# EAGLE design RawWaves_v1-1 (EAGLE 9.6.2)
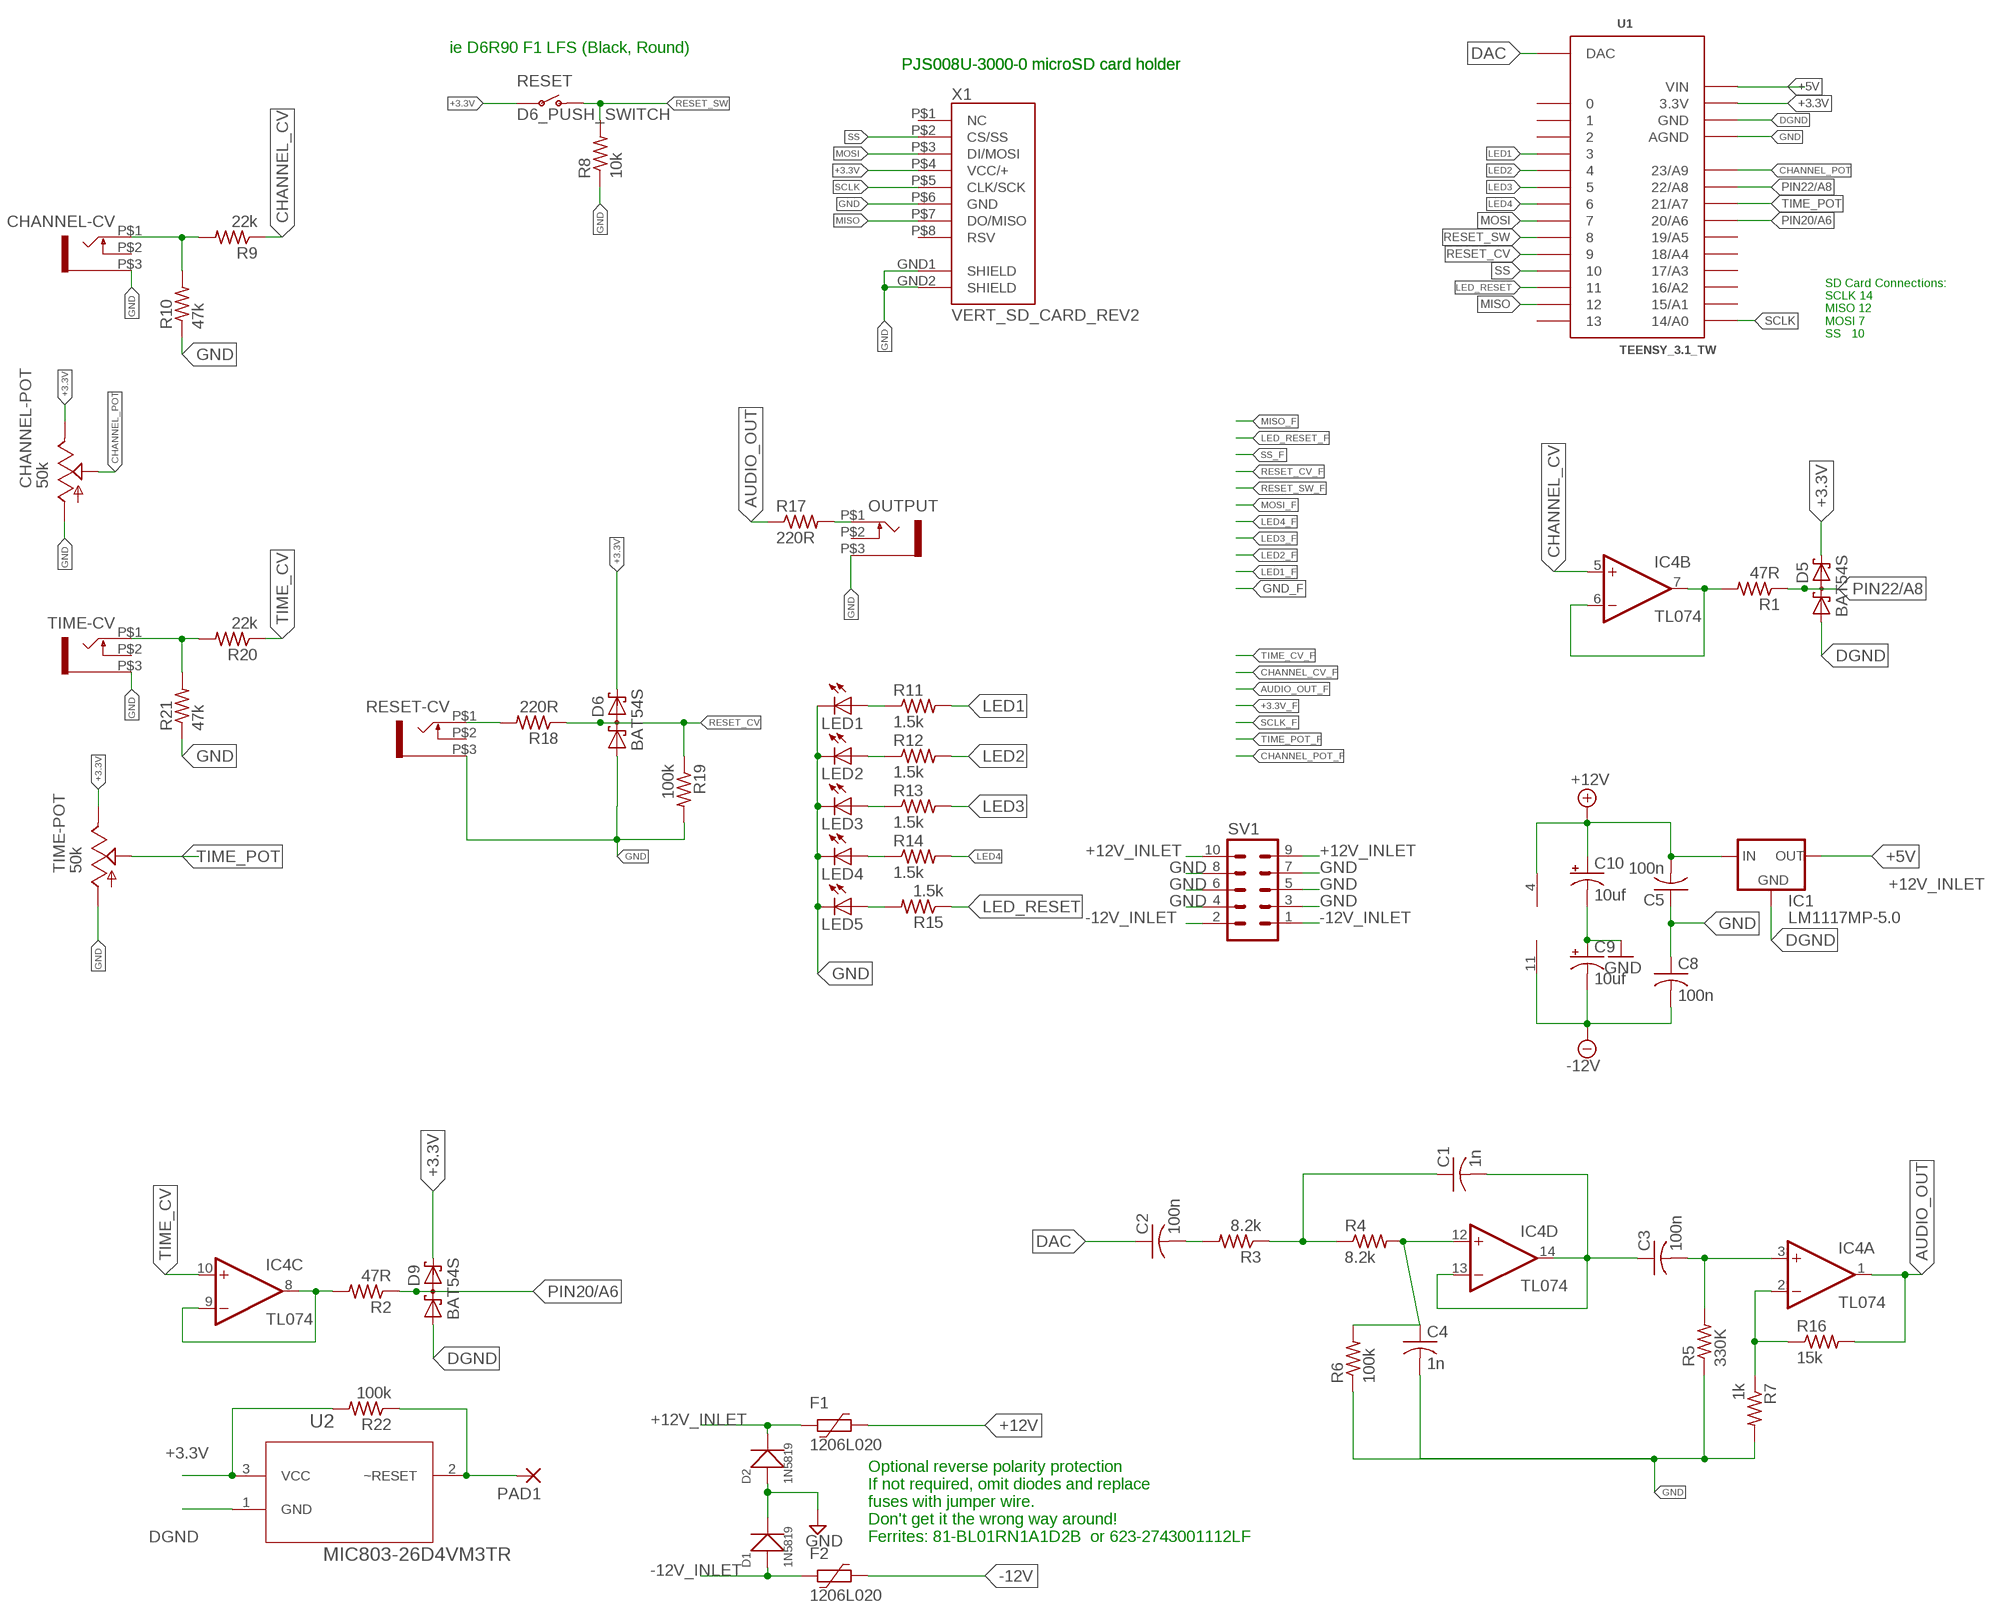
[diagram p0: schematic, sheet 1]

## Parts
C1  1n  C-USC0805  [C0805]
C2  100n  C-USC0805  [C0805]
C3  100n  C-USC0805  [C0805]
C4  1n  C-USC0805  [C0805]
C5  100n  C-USC0805  [C0805]
C8  100n  C-USC0805  [C0805]
C9  10uf  CPOL-USB  [PANASONIC_B]
C10  10uf  CPOL-USB  [PANASONIC_B]
CHANNEL-CV  WQP-PJ301M-12_JACK  [WQP-PJ301M-12_JACK]
CHANNEL-POT  50k  ALPHA-9MMF2A  [EVUF]
D1  1N5819  SMD-DIODE-SCHOTTKY-40V-500MA(SOD-123)  [SOD-123]
D2  1N5819  SMD-DIODE-SCHOTTKY-40V-500MA(SOD-123)  [SOD-123]
D5  BAT54S  [SOT23]
D6  BAT54S  [SOT23]
D9  BAT54S  [SOT23]
F1  1206L020  [1206L]
F2  1206L020  [1206L]
IC1  LM1117MP-5.0  [SOT223]
IC4  TL074  TL074D  [SO14]
LED1  LED3MM  [LED3MM]
LED2  LED3MM  [LED3MM]
LED3  LED3MM  [LED3MM]
LED4  LED3MM  [LED3MM]
LED5  LED3MM  [LED3MM]
OUTPUT  WQP-PJ301M-12_JACK  [WQP-PJ301M-12_JACK]
PAD1  1,6/0,9  [1,6/0,9]
R1  47R  R-US_R0805  [R0805]
R2  47R  R-US_R0805  [R0805]
R3  8.2k  R-US_R0805  [R0805]
R4  8.2k  R-US_R0805  [R0805]
R5  330K  R-US_R0805  [R0805]
R6  100k  R-US_R0805  [R0805]
R7  1k  R-US_R0805  [R0805]
R8  10k  R-US_R0805  [R0805]
R9  22k  R-US_R0805  [R0805]
R10  47k  R-US_R0805  [R0805]
R11  1.5k  R-US_R0805  [R0805]
R12  1.5k  R-US_R0805  [R0805]
R13  1.5k  R-US_R0805  [R0805]
R14  1.5k  R-US_R0805  [R0805]
R15  1.5k  R-US_R0805  [R0805]
R16  15k  R-US_R0805  [R0805]
R17  220R  R-US_R0805  [R0805]
R18  220R  R-US_R0805  [R0805]
R19  100k  R-US_R0805  [R0805]
R20  22k  R-US_R0805  [R0805]
R21  47k  R-US_R0805  [R0805]
R22  100k  R-US_R0805  [R0805]
RESET  D6_PUSH_SWITCH  [D6_BUTTON_RND]
RESET-CV  WQP-PJ301M-12_JACK  [WQP-PJ301M-12_JACK]
SV1  10_PIN_HEADER  [MA05-2]
TIME-CV  WQP-PJ301M-12_JACK  [WQP-PJ301M-12_JACK]
TIME-POT  50k  ALPHA-9MMF2A  [EVUF]
U1  TEENSY_3.1_TW  [TEENSY_3.1_TW]
U2  MIC803-26D4VM3TR  [SOT95P232X110-3N]
X1  VERT_SD_CARD_REV2  [VERT_MICROSD_REV2]

## Nets
+3.3V: CHANNEL-POT.3(E) D5.2(C2) D6.2(C2) D9.2(C2) R22.2 RESET.P$3(P) RESET.P$4(P) TIME-POT.3(E) U1.3.3V U2.3(VCC) X1.P$4(VCC/+)
+5V: IC1.2(OUT) IC1.4(OUT) U1.VIN
+12V [power]: C5.2 C10.+ F1.1 IC1.3(IN) IC4.4(P:V+)
+12V_INLET [power]: D2.- F1.2 SV1.9 SV1.10
-12V [power]: C8.2 C9.- F2.1 IC4.11(P:V-)
-12V_INLET [power]: D1.+ F2.2 SV1.1 SV1.2
AUDIO_OUT: IC4.1(A:OUT) R16.2 R17.1
CHANNEL_CV: IC4.5(B:+IN) R9.1
CHANNEL_POT: CHANNEL-POT.2(S) U1.23/A9
DAC: C2.1 U1.DAC
DGND: D5.1(A1) D9.1(A1) IC1.1(GND) U1.GND U2.1(GND)
GND [ground]: C4.2 C5.1 C8.1 C9.+ C10.- CHANNEL-CV.P$3 CHANNEL-POT.1(A) D1.- D2.+ D6.1(A1) LED1.K(C) LED2.K(C) LED3.K(C) LED4.K(C) LED5.K(C) OUTPUT.P$3 R5.1 R6.1 R7.2 R8.1 R10.1 R19.2 R21.1 RESET-CV.P$3 SV1.3 SV1.4 SV1.5 SV1.6 SV1.7 SV1.8 TIME-CV.P$3 TIME-POT.1(A) U1.AGND X1.GND1(SHIELD) X1.GND2(SHIELD) X1.P$6(GND)
LED1: R11.2 U1.3
LED2: R12.2 U1.4
LED3: R13.2 U1.5
LED4: R14.2 U1.6
LED_RESET: R15.1 U1.11
MISO: U1.12 X1.P$7(DO/MISO)
MOSI: U1.7 X1.P$3(DI/MOSI)
N$1: IC4.6(B:-IN) IC4.7(B:OUT) R1.2
N$2: C4.1 IC4.12(D:+IN) R4.2 R6.2
N$3: OUTPUT.P$1 R17.2
N$4: C1.1 R3.1 R4.1
N$5: C1.2 C3.1 IC4.13(D:-IN) IC4.14(D:OUT)
N$6: C3.2 IC4.3(A:+IN) R5.2
N$7: IC4.2(A:-IN) R7.1 R16.1
N$8: IC4.8(C:OUT) IC4.9(C:-IN) R2.2
N$9: CHANNEL-CV.P$1 R9.2 R10.2
N$10: C2.2 R3.2
N$11: LED2.A R12.1
N$12: LED4.A R14.1
N$13: LED3.A R13.1
N$14: R18.2 RESET-CV.P$1
N$15: LED1.A R11.1
N$16: LED5.A R15.2
N$17: PAD1.1(P) R22.1 U2.2(~RESET)
PIN20/A6: D9.3(C1A2) R2.1 U1.20/A6
PIN22/A8: D5.3(C1A2) R1.1 U1.22/A8
RESET_CV: D6.3(C1A2) R18.1 R19.1 U1.9
RESET_SW: R8.2 RESET.P$1(O) RESET.P$2(O) U1.8
SCLK: U1.14/A0 X1.P$5(CLK/SCK)
SS: U1.10 X1.P$2(CS/SS)
TEMP: R20.2 R21.2 TIME-CV.P$1
TIME_CV: IC4.10(C:+IN) R20.1
TIME_POT: TIME-POT.2(S) U1.21/A7
Unconnected: CHANNEL-CV.P$2 OUTPUT.P$2 RESET-CV.P$2 TIME-CV.P$2 U1.0 U1.1 U1.2 U1.13 U1.15/A1 U1.16/A2 U1.17/A3 U1.18/A4 U1.19/A5 X1.P$1(NC) X1.P$8(RSV)

## Notes on the sheet
- ie D6R90 F1 LFS (Black, Round)
- PJS008U-3000-0 microSD card holder | PJS008U-3000-0 microSD card holder
- SD Card Connections: 
   SCLK 14
   MISO 12
   MOSI 7 
   SS   10
- Optional reverse polarity protection
  If not required, omit diodes and replace
  fuses with jumper wire. 
  Don't get it the wrong way around! 
  Ferrites: 81-BL01RN1A1D2B  or 623-2743001112LF

## Library data of the parts
C1-C5 C8 = rcl:C-US: CAPACITOR, American symbol; SPICEPREFIX: C
C9 C10 = resistor:CPOL-US: POLARIZED CAPACITOR, American symbol
CHANNEL-CV OUTPUT RESET-CV TIME-CV = thonkiconn:WQP-PJ301M-12_JACK
CHANNEL-POT TIME-POT = TomW:ALPHA-9MM: 9 mm Square Rotary Potentiometers Source: Panasonic
D1 D2 = Seeed-Diode:SMD-DIODE-SCHOTTKY-40V-500MA(SOD-123): 304020012; MPN: B0540W; VALUE: 40V-500MA
D5 D6 D9 = diode:BAT54S: Schottky Diodes Pin connection corrected 2011-05-04 Source: Fairchild .. BAT54.pdf
F1 F2 = polyfuse-smd_10:?: Polyfuse Resettable PTC Source: http://www.littelfuse.com/products/resettable-ptcs.aspx; MF: Littelfuse; MPN: 1206L020; OC_FARNELL: 2072173; OC_NEWARK: 05M2300
IC1 = lm1117:LM1117?-*: 800mA Low-Dropout Linear Regulator Source: http://ww1.microchip.com/downloads/en/DeviceDoc/39760d.pdf; MF: Texas Instruments; MPN: LM1117MP-5.0; OC_FARNELL: 9778209; OC_NEWARK: 28X3417
IC4 = linear:TL074: OP AMP
LED1-LED5 = TomW:LED: LED OSRAM: - CHIPLED LG R971, LG N971, LY N971, LG Q971, LY Q971, LO R971, LY R971 LH N974, LH R974 LS Q976, LO Q976, LY Q976 LO Q996 - Hyper CHIPLED LW Q18S LB Q993, LB Q99A, LB R99A - SideLED LS A670, LO A670, LY A670, LG A670, LP A670 LB A673, LV A673, LT A673, LW A673 LH A674 LY A675 LS A676, LA A676, LO A676, LY A676, LW A676 LS A679, LY A679, LG A679 - Hyper Micro SIDELED® LS Y876, LA Y876, LO Y876, LY Y876 LT Y87S - SmartLED LW L88C, LW L88S LB L89C, LB L89S, LG L890 LS L89K, LO L89K, LY L89K LS L896, LA L896, LO L896, LY L896 - TOPLED LS T670, LO T670, LY T670, LG T670, LP T670 LSG T670, LSP T670, LSY T670, LOP T670, LYG T670 LG T671, LOG T671, LSG T671 LB T673, LV T673, LT T673, LW T673 LH T674 LS T676, LA T676, LO T676, LY T676, LB T676, LH T676, LSB T676, LW T676 LB T67C, LV T67C, LT T67C, LS T67K, LO T67K, LY T67K, LW E67C LS E67B, LA E67B, LO E67B, LY E67B, LB E67C, LV E67C, LT E67C LW T67C LS T679, LY T679, LG T679 LS T770, LO T770, LY T770, LG T770, LP T770 LB T773, LV T773, LT T773, LW T773 LH T774 LS E675, LA E675, LY E675, LS T675 LS T776, LA T776, LO T776, LY T776, LB T776 LHGB T686 LT T68C, LB T68C - Hyper Mini TOPLED® LB M676 - Mini TOPLED Santana® LG M470 LS M47K, LO M47K, LY M47K Source: http://www.osram.convergy.de LUXEON: - LUMILED® LXK2-PW12-R00, LXK2-PW12-S00, LXK2-PW14-U00, LXK2-PW14-V00 LXK2-PM12-R00, LXK2-PM12-S00, LXK2-PM14-U00 LXK2-PE12-Q00, LXK2-PE12-R00, LXK2-PE12-S00, LXK2-PE14-T00, LXK2-PE14-U00 LXK2-PB12-K00, LXK2-PB12-L00, LXK2-PB12-M00, LXK2-PB14-N00, LXK2-PB14-P00, LXK2-PB14-Q00 LXK2-PR12-L00, LXK2-PR12-M00, LXK2-PR14-Q00, LXK2-PR14-R00 LXK2-PD12-Q00, LXK2-PD12-R00, LXK2-PD12-S00 LXK2-PH12-R00, LXK2-PH12-S00 LXK2-PL12-P00, LXK2-PL12-Q00, LXK2-PL12-R00 Source: www.luxeon.com KINGBRIGHT: KA-3528ASYC Source: www.kingbright.com
PAD1 = wirepad:1,6/0,9: THROUGH-HOLE PAD
R1-R22 = rcl:R-US_: RESISTOR, American symbol; SPICEPREFIX: R
RESET = TomW:D6_PUSH_SWITCH
SV1 = TomW:10_PIN_HEADER: PIN HEADER; OC_FARNELL: unknown; OC_NEWARK: unknown
U1 = TomW:TEENSY_3.1_TW: Basic Teensy 3.0 with none of the 'inner' pins enabled. See '+4', 'AllAnalogPins", and 'AllPins' packages for additional pin holes, as needed.
U2 = Micrel_By_element14_Batch_1:MIC803-26D4VM3TR: 3 Pin Microprocessor Supervisor Circuit with Open Drain Reset Output; MPN: MIC803-26D4VM3TR; OC_FARNELL: 1924763; OC_NEWARK: 58T4945; PACKAGE: SOT-23-3; SUPPLIER: MICREL SEMICONDUCTOR
X1 = TomW:VERT_SD_CARD_REV2

## Net classes
0 default: width 0.203 mm
1 power: width 0.305 mm
2 ground: width 0.305 mm

## Board
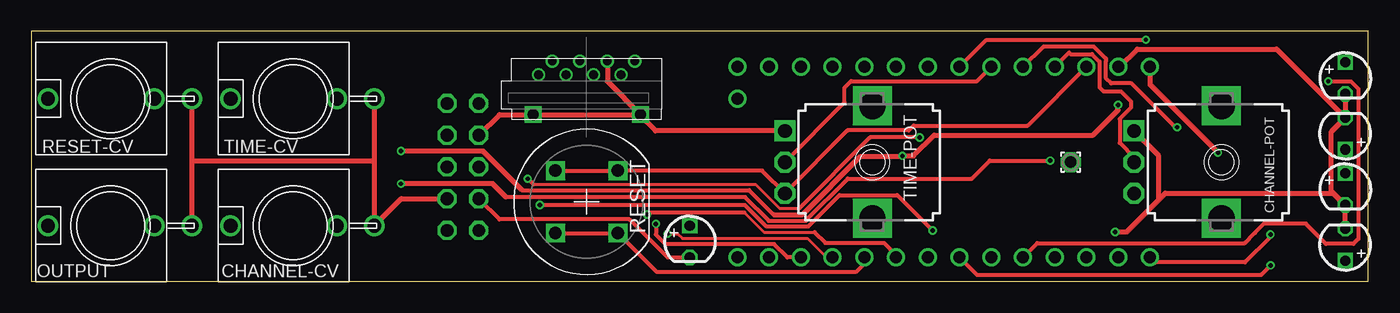
[diagram p1: board, top side]
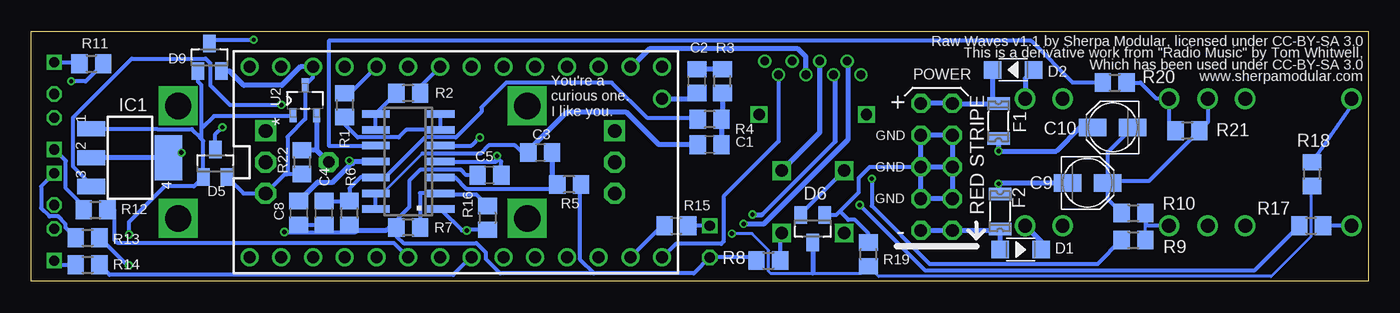
[diagram p2: board, bottom side, seen from below]

Size 107 x 20 mm. Coordinates in mm from the lower left corner, seen from the top.
Outline: 0,20 0,0 107,0 107,20 0,20
Copper layers (1*2*15*16): Top 0.035mm / dielectric 0.2mm / Route2 0.0175mm / dielectric 1.1mm / Route15 0.0175mm / dielectric 0.2mm / Bottom 0.035mm
Design rules "SeeedStudio_DRU_no_angle_20130527": minimum track width 6mil, minimum drill 12mil, track to track 6mil, track to pad 6mil, pad to pad 6mil, via to via 6mil, smd to smd 0mil, copper to edge 10mil, drill to drill 10mil, minimum pad ring 6mil, minimum via ring 6mil, stop-mask expansion 2mil, vias tented up to drill 25mil, thermal gap 10mil

### Footprints (pad centres in the part's own frame; a part is rotated, then mirrored left to right if it is on the bottom)
C0805 = smd 1.3 x 1.5: 1 -0.95,0; 2 0.95,0
PANASONIC_B = smd 2.2 x 1.4: + 1.6,0; - -1.6,0
WQP-PJ301M-12_JACK = drill 1.1: P$1 0,5; P$2 0,-3.5; P$3 0,-6.5
EVUF = drill 1.1 pad 1.676 square: 1 -2.5,-7 | drill 1.1 pad 1.676 octagon: 2 0,-7; 3 2.5,-7 | drill 2.1 pad 2.8 square: M1 4.5,0; M2 -4.5,0
SOD-123 = smd 1.397 x 1.397: + -1.651,0; - 1.651,0
SOT23 = smd 1 x 1.4: 1 -0.95,-1.1; 2 0.95,-1.1; 3 0,1.1
1206L = smd 1 x 1.8: 1 -1.4,0; 2 1.4,0
SOT223 = smd 1.219 x 2.235: 1 -2.311,-3.099; 2 0,-3.099; 3 2.311,-3.099 | smd 3.6 x 2.2: 4 0,3.099
SO14 = smd 0.6 x 2.2: 1 -3.81,-2.6; 2 -2.54,-2.6; 3 -1.27,-2.6; 4 0,-2.6; 5 1.27,-2.6; 6 2.54,-2.6; 7 3.81,-2.6; 8 3.81,2.6; 9 2.54,2.6; 10 1.27,2.6; 11 0,2.6; 12 -1.27,2.6; 13 -2.54,2.6; 14 -3.81,2.6
LED3MM = drill 0.813 square: A -1.27,0 | drill 0.813 octagon: K 1.27,0
1,6/0,9 = drill 0.914 pad 1.6 octagon: 1 0,0
R0805 = smd 1.3 x 1.5: 1 -0.95,0; 2 0.95,0
D6_BUTTON_RND = drill 1 square: P$1 -2.5,2.5; P$2 2.5,2.5; P$3 2.5,-2.5; P$4 -2.5,-2.5
MA05-2 = drill 1.016 octagon: 1 -5.08,-1.27; 2 -5.08,1.27; 3 -2.54,-1.27; 4 -2.54,1.27; 5 0,-1.27; 6 0,1.27; 7 2.54,-1.27; 8 2.54,1.27; 9 5.08,-1.27; 10 5.08,1.27
TEENSY_3.1_TW = drill 0.965: 0 -7.62,13.97; 1 -7.62,11.43; 2 -7.62,8.89; 3 -7.62,6.35; 3.3V 7.62,11.43; 4 -7.62,3.81; 5 -7.62,1.27; 6 -7.62,-1.27; 7 -7.62,-3.81; 8 -7.62,-6.35; 9 -7.62,-8.89; 10 -7.62,-11.43; 11 -7.62,-13.97; 12 -7.62,-16.51; 13 7.62,-16.51; 14/A0 7.62,-13.97; 15/A1 7.62,-11.43; 16/A2 7.62,-8.89; 17/A3 7.62,-6.35; 18/A4 7.62,-3.81; 19/A5 7.62,-1.27; 20/A6 7.62,1.27; 21/A7 7.62,3.81; 22/A8 7.62,6.35; 23/A9 7.62,8.89; AGND 7.62,13.97; DAC 5.08,-16.51; GND -7.62,16.51; VIN 7.62,16.51
SOT95P232X110-3N = smd 1.118 x 0.559: 1 -1.194,0.94; 2 -1.194,-0.94; 3 1.194,0
VERT_MICROSD_REV2 = drill 0.9 square: GND1 -4.3,-3.17; GND2 4.3,-3.17 | drill 0.7: P$1 -3.85,0; P$2 -2.75,1.1; P$3 -1.65,0; P$4 -0.55,1.1; P$5 0.55,0; P$6 1.65,1.1; P$7 2.75,0; P$8 3.85,1.1

### Placement (x,y rotation side)
C1  52.7,10.92 180 bottom
C2  53.72,16 90 bottom
C3  66.28,10.31 0 bottom
C4  83.57,5.46 270 bottom
C5  70.34,8.49 0 bottom
C8  85.6,5.46 90 bottom
C9  22.48,7.87 0 bottom
C10  20.45,12.32 180 bottom
CHANNEL-CV  20.95,4.45 90 top
CHANNEL-POT  95.25,9.53 270 top
D1  27.81,2.54 0 bottom
D2  28.41,16.91 180 bottom
D5  92.27,9.44 0 bottom
D6  44.45,4.21 180 bottom
D9  92.72,17.91 0 bottom
F1  29.59,12.81 90 bottom
F2  29.46,5.59 270 bottom
IC1  99.11,9.89 270 bottom
IC4  76.83,9.57 90 bottom
LED1  105.16,16.26 270 top
LED2  105.16,11.81 90 top
LED3  105.16,7.37 270 top
LED4  105.16,2.92 90 top
LED5  52.7,3.17 270 top
OUTPUT  6.35,4.45 90 top
PAD1  83.18,9.53 0 top
R1  81.92,14.1 270 bottom
R2  76.83,15.04 180 bottom
R3  51.69,16 90 bottom
R4  52.7,12.95 180 bottom
R5  63.95,7.75 180 bottom
R6  81.53,5.46 90 bottom
R7  76.83,4.3 180 bottom
R8  48.01,1.65 0 bottom
R9  18.8,3.3 0 bottom
R10  18.8,5.46 0 bottom
R11  102.19,17.41 0 bottom
R12  101.85,5.71 0 bottom
R13  102.49,3.48 0 bottom
R14  102.49,1.32 0 bottom
R15  55.37,4.45 0 bottom
R16  70.48,5.08 270 bottom
R17  4.57,4.45 0 bottom
R18  4.5,8.58 90 bottom
R19  40.01,2.16 90 bottom
R20  20.29,15.89 0 bottom
R21  14.48,12.05 180 bottom
R22  85.34,9.53 270 bottom
RESET  44.45,6.35 180 top
RESET-CV  6.35,14.61 90 top
SV1  34.54,9.14 90 bottom
TIME-CV  20.95,14.61 90 top
TIME-POT  67.31,9.53 270 top
U1  73.03,9.53 90 bottom
U2  85.09,14.48 90 bottom
X1  44.45,16.51 0 top

### Tracks (layer width: path | path; a pad name or v marks a point on that pad's centre or on a via)
+3.3V
  Top 0.305: RESET.P$3 RESET.P$4 58.48,8.85 TIME-POT.3 60.31,7.05 65.33,12.06 70.23,12.06 70.61,12.45 79.76,12.45 U1.3.3V
  Bottom 0.305: RESET.P$3 45.4,5.4 D6.2 | 86.49,8.57 86.7,8.57 CHANNEL-POT.3 90.01,7.03 D5.2 | U1.3.3V 84.45,16.31 U2.3 85.06,15.65 85.06,12.98 86.49,11.56 86.49,8.57 | R22.2 86.49,8.57
  Bottom 0.406: X1.P$4 43.9,11.9 RESET.P$4 | U1.3.3V 85.47,17.14 86.95,15.66 89.98,15.66 91.12,16.81 D9.2
+5V  (via drill 0.35)
  Top 0.406: U1.VIN 89.53,15.74 94.97,10.31 v94.97,10.29
  Bottom 0.406: IC1.2 IC1.4 95.37,9.89 v94.97,10.29
+12V  (via drill 0.35)
  Top 0.305: 39.3,7.29 57.46,7.29 59.41,5.33 | 69.67,9.98 v69.72,10.03
  Top 0.406: 39.3,7.29 36.17,10.41 v29.59,10.41 | 69.67,9.98 66.36,9.98 61.71,5.33 59.41,5.33 | v86.98,14.11 86.98,13.7 84.97,11.69 72.27,11.69 70.61,10.03 v69.72,10.03
  Bottom 0.305: C10.+ 23.06,12.32 | 69.78,9.97 v69.72,10.03 | IC4.4 69.78,9.57 69.78,9.97 | v86.98,14.11 91.11,14.11 92.67,15.67 92.67,17.43 93.05,17.81 98.96,17.81 103.64,13.13 103.64,9.15 102.21,7.73 IC1.3 | C5.2 69.39,9.58 69.78,9.97
  Bottom 0.406: F1.1 v29.59,10.41 24.98,10.41 23.06,12.32
+12V_INLET
  Bottom 0.406: SV1.10 SV1.9 33.26,14.21 F1.2 30.06,14.68 D2.-
-12V  (via drill 0.35)
  Top 0.305: 38,6.73 57.13,6.73 59.04,4.83 61.98,4.83 65.35,8.2 75.26,8.2 76.71,9.65 v81.53,9.65
  Top 0.406: v29.59,7.8 36.93,7.8 38,6.73
  Bottom 0.305: 81.53,9.27 v81.53,9.65 81.28,9.4 81.11,9.57 | 29.52,7.87 v29.59,7.8 29.46,7.67 F2.1
  Bottom 0.406: C8.2 84.07,7.93 82.87,7.93 81.53,9.27 | IC4.11 81.11,9.57 | 29.52,7.87 C9.-
-12V_INLET
  Bottom 0.305: 29.59,4.06 F2.2
  Bottom 0.406: SV1.2 SV1.1 29.59,4.06 | F2.2 D1.+
AUDIO_OUT  (via drill 0.35)
  Top 0.305: v40.69,6.1 57.12,6.1 58.85,4.37 62.16,4.37 64.68,6.89 69.31,6.89 v72.14,4.06
  Bottom 0.305: v40.69,6.1 35.49,0.89 9.08,0.89 R17.1 | IC4.1 72.54,4.06 v72.14,4.06 72.07,4.13 R16.2
CHANNEL_CV  (via drill 0.35)
  Top 0.254: 40.19,7.74 57.97,7.74 59.88,5.84 61.47,5.84
  Top 0.305: v71.1,11.5 67.13,11.5 61.47,5.84 | 40.19,7.74 v39.73,8.2
  Bottom 0.305: v71.1,11.5 71.76,10.84 IC4.5 | v39.73,8.2 39.73,6.02 35.11,1.4 21.65,1.4 R9.1
CHANNEL_POT
  Top 0.305: U1.23/A9 83.06,18.29 83.17,18.17 84.88,18.17 85.48,17.57 85.48,15.52 85.8,15.2 87.2,15.2 88.01,14.39 88.01,13.89 87.11,12.99 87.11,11.06 88.25,9.92 CHANNEL-POT.2
DAC
  Bottom 0.305: 54.17,14.61 C2.1
  Bottom 0.406: U1.DAC 54.17,14.61
DGND  (via drill 0.35)
  Top 0.305: U1.GND 89.94,1.5 97.13,1.5 99.17,3.54 v99.17,3.75
  Bottom 0.305: U2.1 86.1,13.22 92.37,13.22 93.39,12.2 | v99.17,3.75 99.17,4.75 96.33,7.59 93.97,7.59 D5.1 93.22,11.23 93.39,11.4 | D9.1 93.67,15.99 93.39,15.71 93.39,12.2 | 93.39,12.2 93.39,11.4 | IC1.1 96.97,12.2 96.93,12.16 94.15,12.16 93.49,11.51 93.39,11.4
GND  (via drill 0.35)
  Top 0.305: 48.64,13.34 X1.GND2 | SV1.4 37.47,4.95 47.88,4.95 50.93,1.91 LED5.K | 104.2,7.05 104.24,7.01 | U1.AGND 87.08,17.14
  Top 0.406: RESET-CV.P$3 12.85,9.6 | 12.85,9.6 OUTPUT.P$3 | TIME-CV.P$3 27.45,9.6 | 27.45,9.6 CHANNEL-CV.P$3 29.61,6.6 SV1.3 | SV1.8 37.47,13.34 X1.GND1 48.64,13.34 49.96,12.03 TIME-POT.1 | X1.P$6 46.1,15.99 X1.GND2 | v86.74,3.94 87.63,3.94 90.19,6.49 | 90.19,6.49 90.74,7.05 104.2,7.05 | CHANNEL-POT.1 90.19,10.09 90.19,6.49 | LED1.K LED2.K | LED2.K 104.04,11.97 104.04,7.21 104.24,7.01 LED3.K LED4.K | 87.08,17.14 88.51,18.57 99.66,18.57 LED2.K | 27.45,9.6 12.85,9.6
  Bottom 0.305: C9.+ 20.88,6.59 R10.1 | v86.74,3.94 85.6,3.94 | 85.6,3.94 83.06,3.94 | 83.06,3.94 81.03,3.94 81.03,4.51 R6.1 81.12,4.1 | 85.6,3.94 C8.1 C4.2 83.06,4.51 83.06,3.94 | 78.38,4.3 R7.2 77.78,3.62 77.22,3.05 71.37,3.05 70.61,2.29 70.61,1.78 69.47,0.64 61.98,0.64 | 26.16,3.15 D1.- | 61.98,0.64 53.98,0.64 LED5.K 49.21,1.91 R8.1 | D6.1 42.57,5.31 42.29,5.59 | 42.29,5.59 40.76,7.12 40.76,8.26 39.88,9.14 SV1.6 | 42.29,5.59 41.61,4.91 41.07,4.91 40.01,3.84 R19.2 | C9.+ 20.88,8 17.57,8 R21.1 12.85,12.72 RESET-CV.P$3 | 61.98,0.64 63.11,1.76 63.11,7.64 R5.1 | 78.38,4.3 76.74,5.93 76.74,8.03 75.86,8.91 72.61,8.91 72.19,8.49 C5.1 | 78.38,4.3 78.58,4.1 | C10.- 20.88,10.29 C9.+
  Bottom 0.406: SV1.5 SV1.7 SV1.8 SV1.4 SV1.3 SV1.5 | SV1.6 SV1.5 | 81.12,4.1 78.58,4.1 | CHANNEL-CV.P$3 26.16,3.15 | D2.+ 27.45,16.22 TIME-CV.P$3
LED1  (via drill 0.35)
  Top 0.305: U1.3 80.52,3.05 97.1,3.05 97.93,3.88 98.65,4.6 102,4.6 103.6,3 105.8,3 106.2,3.4 106.2,15.4 105.6,16 v103.8,16
  Bottom 0.305: R11.2 102.65,16 v103.8,16
LED2
  Bottom 0.305: R12.2 100.33,5.71 100.33,3.3 100.08,3.05 77.98,3.05 U1.4
LED3  (via drill 0.35)
  Top 0.305: v99.19,1.27 98.59,0.67 98.58,0.67 98.41,0.49 75.7,0.49 U1.5
  Bottom 0.305: R13.2 99.33,1.27 v99.19,1.27
LED4
  Bottom 0.305: U1.6 71.82,1.91 73.22,0.51 100.72,0.51 R14.2
LED_RESET
  Bottom 0.305: R15.1 56.52,4.45 U1.11
MISO
  Bottom 0.305: U1.12 55.42,3 51.8,3 51.6,3.2 51.6,6.8 47.2,11.2 X1.P$7
MOSI  (via drill 0.35)
  Top 0.254: 62.68,3.94 58.63,3.94 57.05,5.51
  Top 0.305: U1.7 69.22,2.09 68.24,3.06 63.56,3.06 62.68,3.94 | 57.05,5.51 49.46,5.51 v49.28,5.33
  Bottom 0.305: X1.P$3 42.67,16.38 | 48.51,5.33 42.67,11.18
  Bottom 0.406: v49.28,5.33 48.51,5.33 | 42.67,16.38 42.67,11.18
N$1
  Bottom 0.305: IC4.7 IC4.6 76.99,12.11 77.59,11.51 80.88,11.51 81.92,12.55 R1.2
N$2
  Bottom 0.305: C4.1 R6.2 81.53,7.43 80.66,8.3 IC4.12 78.67,8.3 75.47,11.51 73.01,11.51 70.97,13.54 70.97,13.91 68.99,15.89 60.54,15.89 57.73,13.08 53.78,13.08 R4.2
N$3
  Bottom 0.305: OUTPUT.P$1 R17.2
N$4
  Bottom 0.305: C1.1 51.79,10.96 51.82,11.03 51.76,11.1 | 51.69,13.02 R4.1
  Bottom 0.406: R4.1 51.76,11.1 | R3.1 51.69,13.02
N$5
  Bottom 0.203: C3.1 67.22,9.8
  Bottom 0.254: 78.9,7.03 75.69,10.24
  Bottom 0.305: IC4.14 IC4.13 78.9,7.03 | 75.69,10.24 71.01,10.24 70.39,10.87 68.29,10.87 67.73,10.31 C3.1 | 67.54,10.12 67.22,9.8
  Bottom 0.406: C1.2 56.77,10.92 59.37,13.52 64.14,13.52 67.54,10.12
N$6
  Bottom 0.254: 65.33,8.17 R5.2
  Bottom 0.305: IC4.3 73.07,8.3 72.18,7.41 65.23,7.41 R5.2
  Bottom 0.406: C3.2 65.33,8.17
N$7
  Bottom 0.305: R7.1 75.89,7.06 74.26,7.06 IC4.2 74.16,6.96 71.41,6.96 R16.1
N$8
  Bottom 0.305: IC4.9 IC4.8 R2.2
N$9
  Bottom 0.254: R9.2 R10.2
  Bottom 0.305: CHANNEL-CV.P$1 17.78,4.45 R10.2
N$10
  Bottom 0.406: R3.2 C2.2
N$11
  Bottom 0.305: LED2.A 104.23,9.62 104.23,7.44 102.8,6.01 R12.1
N$12
  Bottom 0.305: LED4.A 104.83,1.32 R14.1
N$13
  Bottom 0.305: LED3.A 106.2,7.59 106.2,5.85 105.53,5.18 104.85,5.18 104.24,4.57 104.24,4.29 R13.1
N$14
  Bottom 0.305: RESET-CV.P$1 1.35,14.04 R18.2
N$15
  Bottom 0.305: R11.1 103.26,17.53 LED1.A
N$16
  Bottom 0.305: LED5.A R15.2
N$17
  Bottom 0.406: U2.2 84.15,10.49 | 84.15,10.49 PAD1.1 | 84.15,10.49 84.17,10.47 R22.1
PIN20/A6  (via drill 0.35)
  Top 0.305: U1.20/A6 76.45,19.3 89.18,19.3 v89.2,19.32
  Bottom 0.305: U1.20/A6 75.89,15.55 R2.1 | D9.3 92.41,19.32 v89.2,19.32
PIN22/A8  (via drill 0.35)
  Top 0.305: U1.22/A8 81.03,18.8 85,18.8 86,17.8 86,17.61 85.97,17.57 85.97,16.28 86.42,15.82 88.05,15.82 91.55,12.32 v91.69,12.32
  Bottom 0.305: U1.22/A8 81.47,15.05 R1.1 | v91.69,12.32 92.31,11.71 92.31,10.57 D5.3
RESET_CV  (via drill 0.35)
  Top 0.254: v50.93,3.81 51.73,3.81 52.11,3.43 62.1,3.43 63.63,1.91 U1.9
  Bottom 0.254: R18.1 4.59,7.54 4.59,3.58 7.78,0.39 39.19,0.39 R19.1 40.59,0.62 44.4,0.62 | v50.93,3.81 49.32,3.81 47.98,2.48 47.98,0.79 47.82,0.62 44.4,0.62 | 44.45,0.67 44.4,0.62
  Bottom 0.406: D6.3 44.45,0.67
RESET_SW
  Top 0.305: RESET.P$2 RESET.P$1 50.04,0.76 66.04,0.76 66.67,1.4 U1.8
  Bottom 0.305: R8.2 47.06,3.74 RESET.P$1
SCLK
  Bottom 0.305: U1.14/A0 58.97,17.14
  Bottom 0.406: 58.97,17.14 57.48,18.64 45.69,18.64 45.03,17.98 45.03,16.54 X1.P$5
SS  (via drill 0.35)
  Top 0.305: U1.10 60.51,1.91 59.44,2.97 50.75,2.97 49.99,3.73 v49.99,4.59
  Bottom 0.305: X1.P$2 41.66,17.57
  Bottom 0.406: 41.66,17.57 41.66,11.3 48.37,4.59 v49.99,4.59
TEMP
  Bottom 0.305: R21.2 15.96,12.57 TIME-CV.P$1 16.95,14.61 18.23,15.88 18.24,15.89 R20.2
TIME_CV
  Bottom 0.305: R20.1 23.64,15.89 26.98,19.23 83.19,19.23 83.19,10.84 IC4.10
TIME_POT
  Top 0.305: TIME-POT.2 65.1,14.31 65.1,15.49 65.61,16 75.69,16 U1.21/A7

### Text on the board
bPlace: Raw Waves v1.1 by Sherpa Modular, licensed under CC-BY-SA 3.0 / This is a derivative work from "Radio Music" by Tom Whitwell, / Which has been used under CC-BY-SA 3.0 / www.sherpamodular.com | You're a / curious one. / I like you. | ■